# EAGLE design Rain Collector Inside v2 (EAGLE 7.1.0)
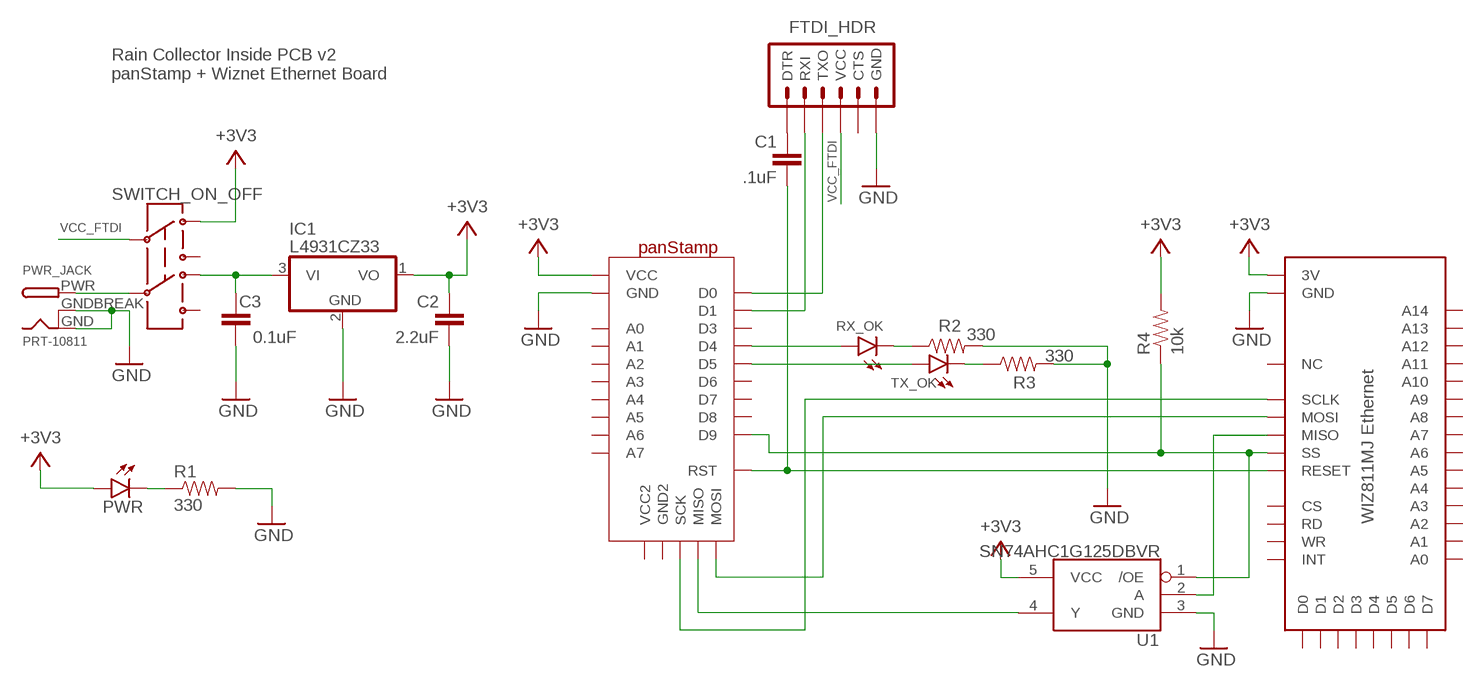
[diagram p0: schematic, sheet 1]

## Parts
C1  .1uF  CAPPTH1  [CAP-PTH-5MM]
C2  2.2uF  CAPPTH1  [CAP-PTH-5MM]
C3  0.1uF  CAPPTH1  [CAP-PTH-5MM]
FTDI_HDR  ARDUINO_SERIAL_PROGRAMLONGPADS  [1X06_LONGPADS]
IC1  L4931CZ33  78L15Z  [TO92]
PANSTAMP  PANSTAMP_SPI  [PANSTAMP_SPI]
PWR  LED5MM  [LED5MM]
PWR_JACK  PRT-10811  DCBARRELPTH  [DCJACK_2MM_PTH]
R1  330  RESISTORPTH-1/4W  [AXIAL-0.4]
R2  330  RESISTORPTH-1/4W  [AXIAL-0.4]
R3  330  RESISTORPTH-1/4W  [AXIAL-0.4]
R4  10k  RESISTORPTH-1/4W  [AXIAL-0.4]
RX_OK  LED5MM  [LED5MM]
SWITCH_ON_OFF  401-2001-ND  SWITCH_DPDTPTH  [SWITCH_DPDT_PTH]
TX_OK  LED5MM  [LED5MM]
U1  SN74AHC1G125DBVR  74AHC1G125  [SOT23-5]
U$2  WIZ811MJ  [WIZ811MJ]

## Nets
+3V3: C2.1 IC1.1(VO) PANSTAMP.VCC PWR.A R4.P$2 SWITCH_ON_OFF.1 U1.5(VCC) U$2.3V@1(3V) U$2.3V@2(3V)
DTR: C1.1 FTDI_HDR.1(DTR)
GND: C2.2 C3.2 FTDI_HDR.6(GND) IC1.2(GND) PANSTAMP.GND$1(GND) PANSTAMP.GND$7(GND) PANSTAMP.GND$15(GND) PANSTAMP.GND$23(GND) PANSTAMP.GND$24(GND) PWR_JACK.GND PWR_JACK.GNDBREAK R1.P$2 R2.P$2 R3.P$2 U1.3(GND) U$2.GND@1(GND) U$2.GND@2(GND) U$2.GND@3(GND) U$2.GND@4(GND) U$2.GND@5(GND)
MISO: PANSTAMP.MISO U1.4(Y)
MOSI: PANSTAMP.MOSI U$2.MOSI
N$1: FTDI_HDR.3(TXO) PANSTAMP.D0
N$2: FTDI_HDR.2(RXI) PANSTAMP.D1
N$3: PWR_JACK.PWR SWITCH_ON_OFF.5
N$4: PWR.K(C) R1.P$1
N$6: U1.2(A) U$2.MISO
N$7: R2.P$1 RX_OK.K(C)
N$8: R3.P$1 TX_OK.K(C)
N$9: C3.1 IC1.3(VI) SWITCH_ON_OFF.4
RST: C1.2 PANSTAMP.RESET(RST) U$2.RESET
RXLED: PANSTAMP.D4 RX_OK.A
SCLK: PANSTAMP.SCK U$2.SCLK
SS: PANSTAMP.D9 R4.P$1 U1.1(/OE) U$2.SCS(SS)
TXLED: PANSTAMP.D5 TX_OK.A
VCC_FTDI: FTDI_HDR.4(VCC) SWITCH_ON_OFF.2
Unconnected: FTDI_HDR.5(CTS) PANSTAMP.A0 PANSTAMP.A1 PANSTAMP.A2 PANSTAMP.A3 PANSTAMP.A4 PANSTAMP.A5 PANSTAMP.A6 PANSTAMP.A7 PANSTAMP.D3 PANSTAMP.D6 PANSTAMP.D7 PANSTAMP.D8 SWITCH_ON_OFF.3 SWITCH_ON_OFF.6 U$2.A0 U$2.A1 U$2.A2 U$2.A3 U$2.A4 U$2.A5 U$2.A6 U$2.A7 U$2.A8 U$2.A9 U$2.A10 U$2.A11 U$2.A12 U$2.A13 U$2.A14 U$2.CS U$2.D0 U$2.D1 U$2.D2 U$2.D3 U$2.D4 U$2.D5 U$2.D6 U$2.D7 U$2.INT U$2.NC U$2.RD U$2.WR

## Notes on the sheet
- Rain Collector Inside PCB v2
  panStamp + Wiznet Ethernet Board

## Power pins joined to a net without a drawn wire
GND2: PANSTAMP.GND2
VCC2: PANSTAMP.VCC2

## Library data of the parts
C1-C3 = SparkFun-Capacitors:CAP: Capacitor Standard 0603 ceramic capacitor, and 0.1" leaded capacitor.
FTDI_HDR = SparkFun-Connectors:ARDUINO_SERIAL_PROGRAM: FTDI connector footprints
IC1 = adafruit:78*: Positive VOLTAGE REGULATOR Added bigger pads to the TO-92 package
PANSTAMP = SRG:PANSTAMP_SPI
PWR RX_OK TX_OK = SparkFun-LED:LED: LEDs Standard schematic elements and footprints for 5mm, 3mm, 1206, and 0603 sized LEDs. 5mm - Spark Fun Electronics SKU : COM-00529 (and others)
PWR_JACK = adafruit:DCBARREL: 2.0mm DC Barrel Jack DCJACK_2MM_PTH - Through Hole Jack (4UConnector: 05537)
R1-R4 = SparkFun-Resistors:RESISTOR: Resistor Basic schematic elements and footprints for 0603, 1206, and PTH resistors.
SWITCH_ON_OFF = SRG:SWITCH_DPDT: Switch DPDT PTH version - C&K # JS202011CQN, Digikey #401-2001-ND 300 mA rating
U1 = SparkFun-DigitalIC:74AHC1G125: Single bus buffer gate with 3-state output
U$2 = SRG:WIZ811MJ: WIZnet W5100 Ethernet Network Module - WIZ811MJ Sparkfun https://www.sparkfun.com/products/9473 Product Page: http://bly/U4KDqQ

## Net classes
0 default: width 0.61 mm, drill 0.508 mm, clearance 0.381 mm

## Board
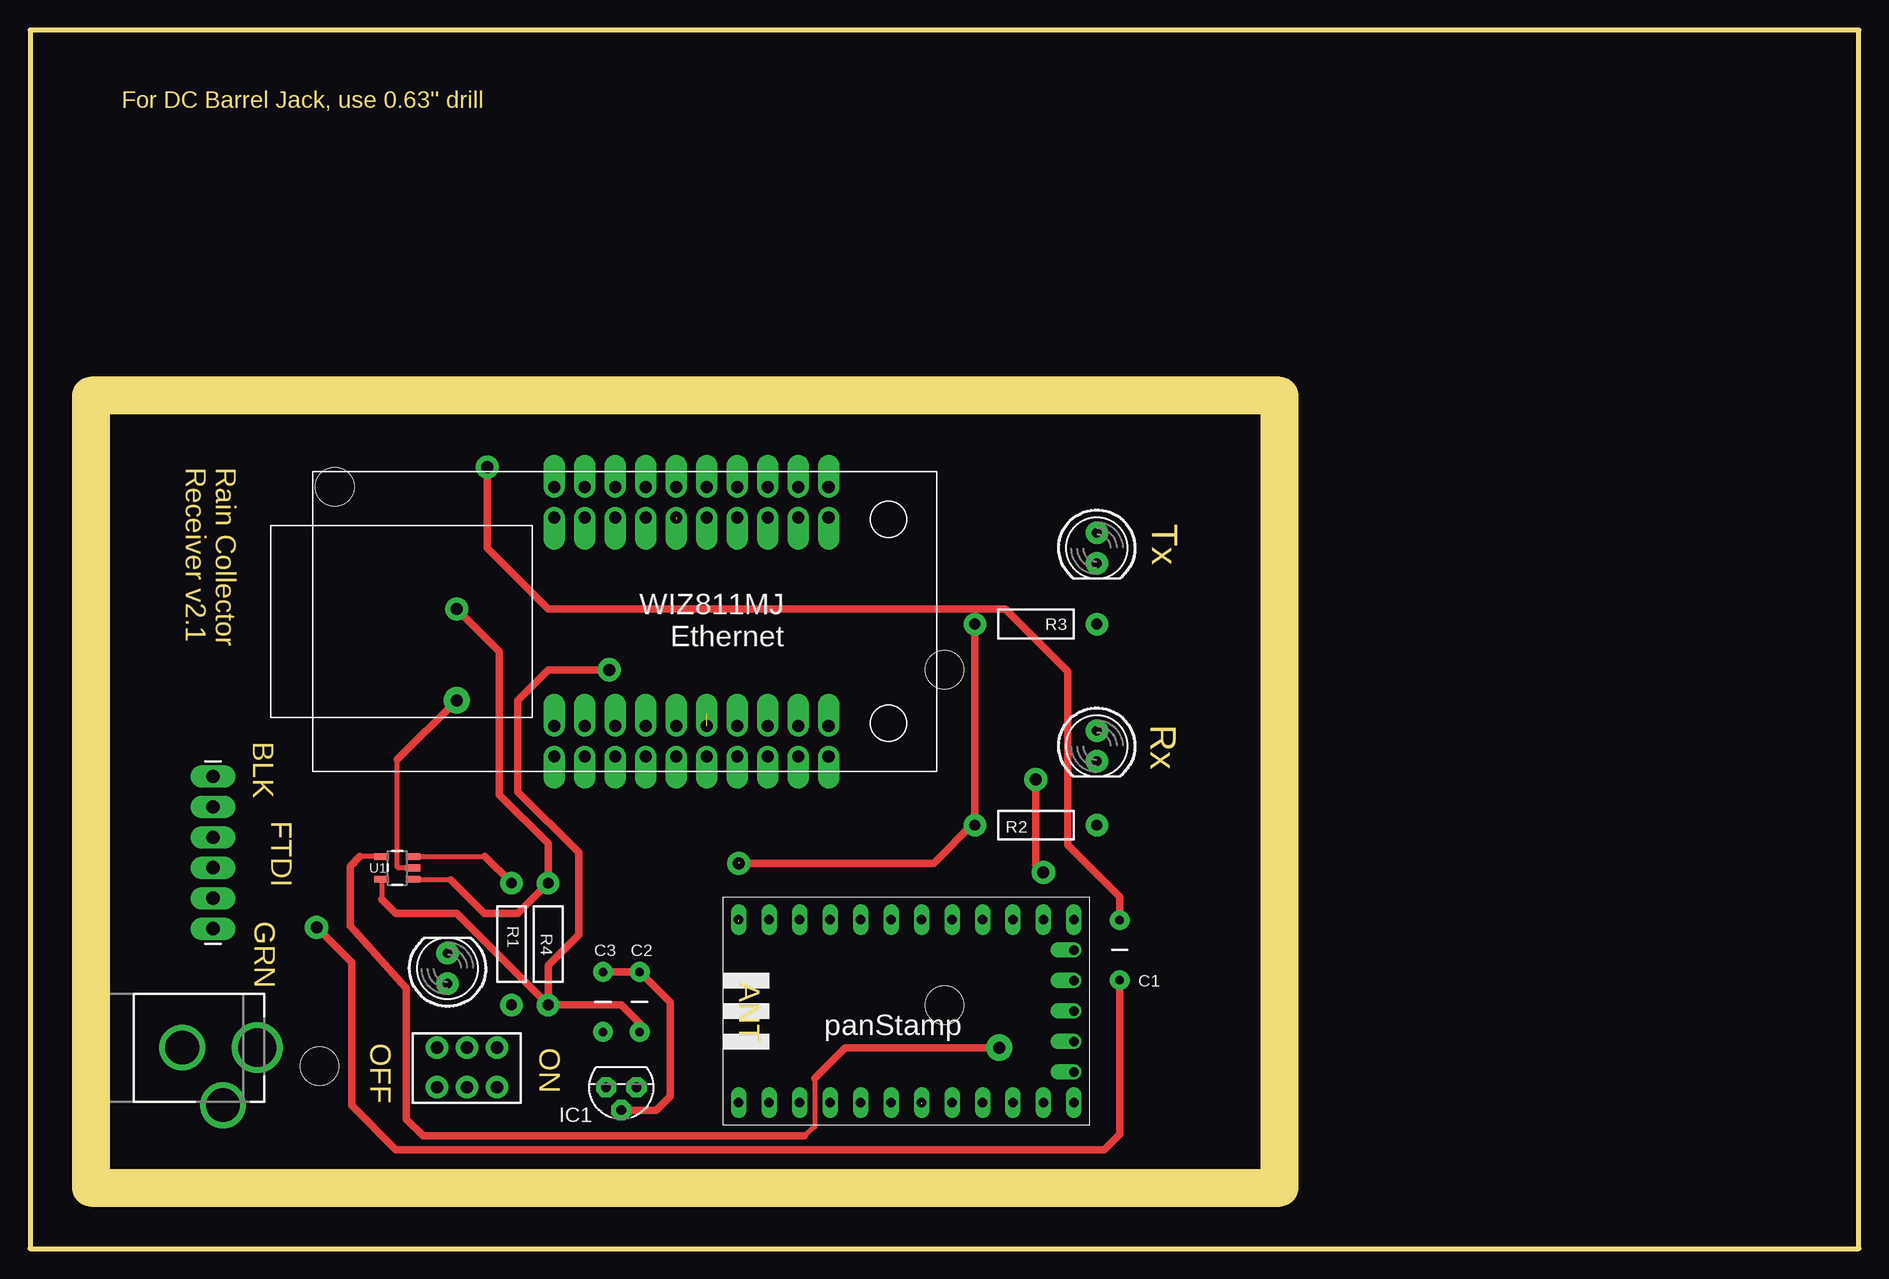
[diagram p1: board, top side]
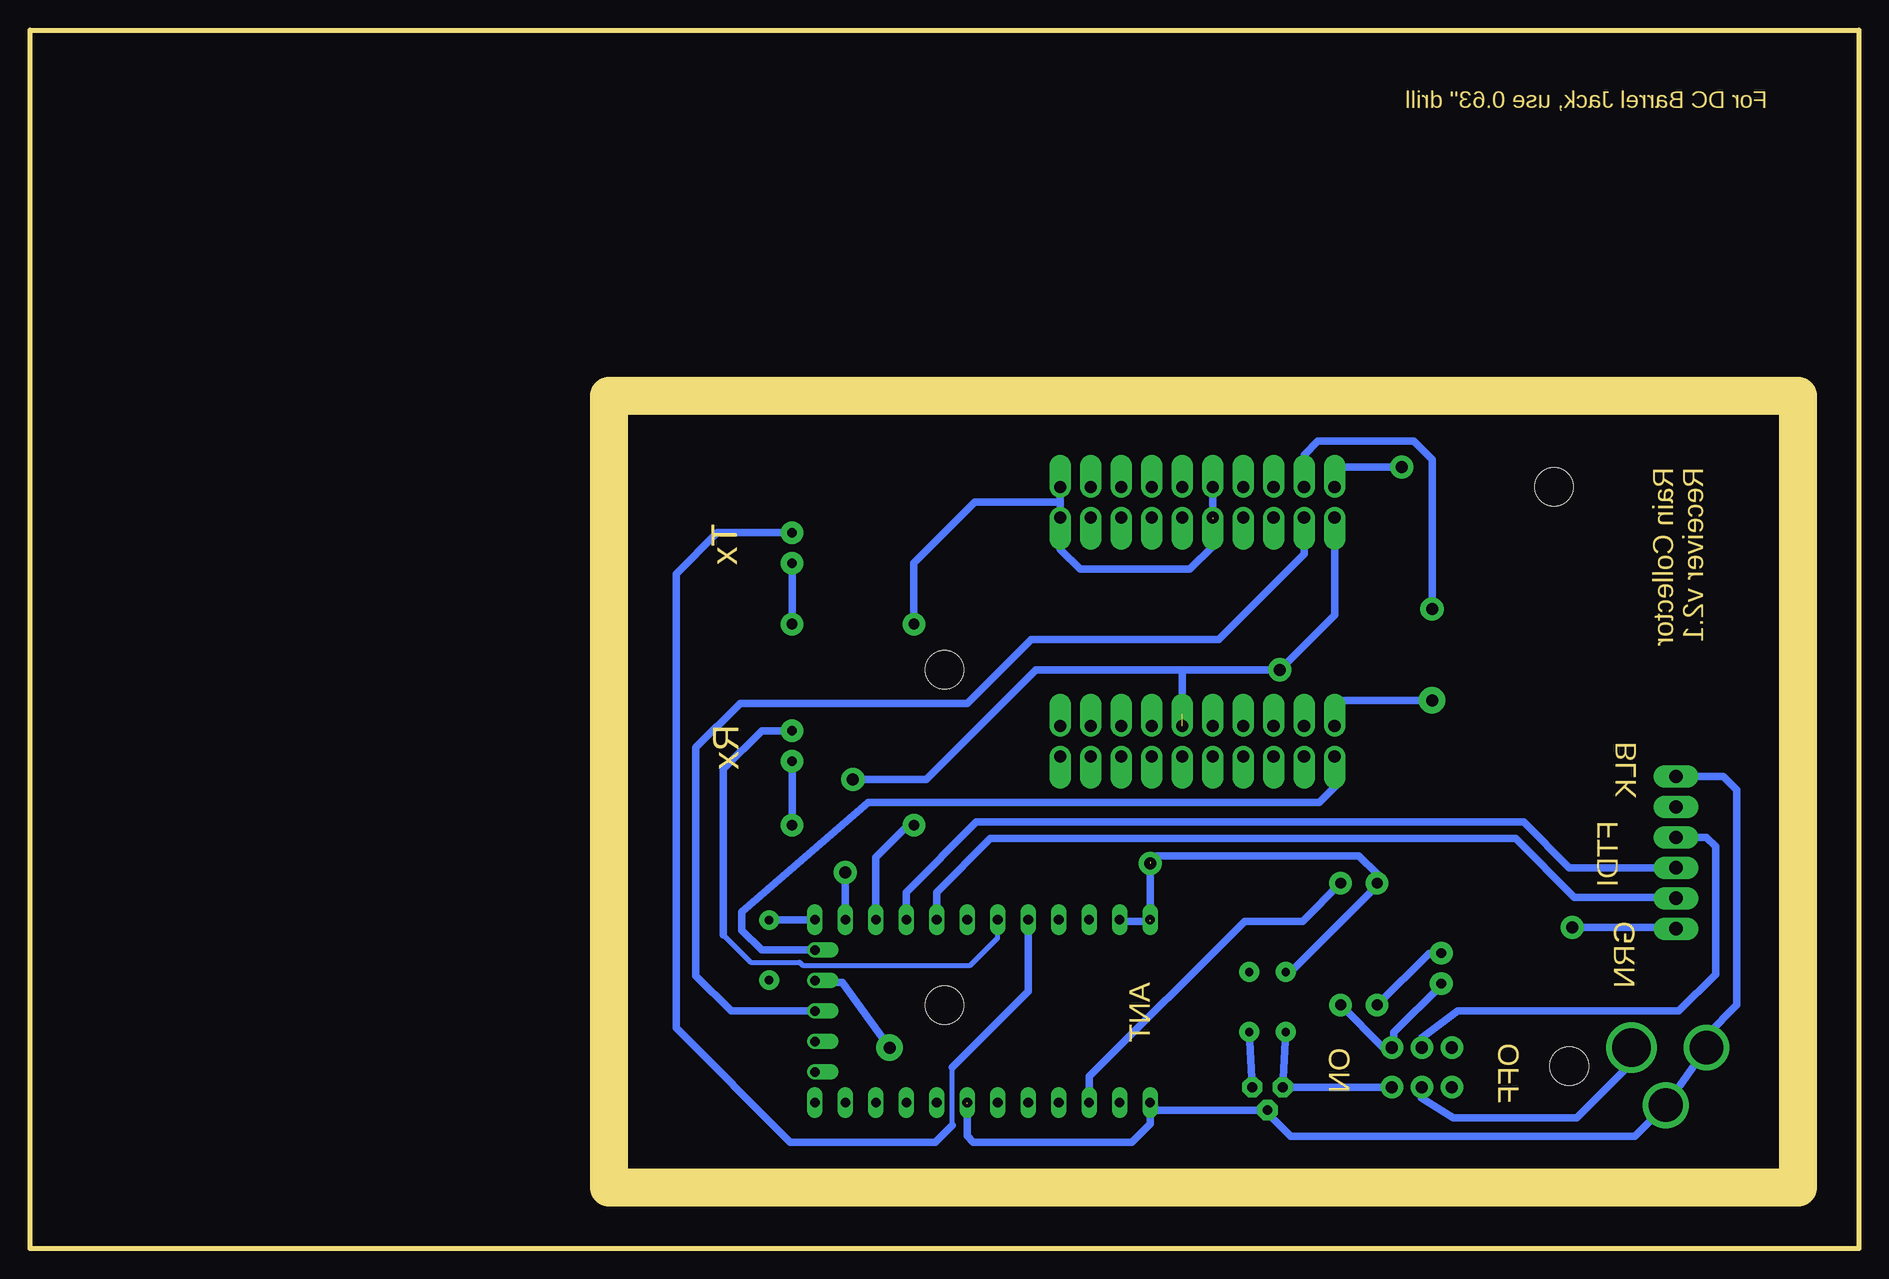
[diagram p2: board, bottom side, seen from below]

Size 152.4 x 101.6 mm. Coordinates in mm from the lower left corner, seen from the top.
Outline: 0,0 152.4,0 152.4,101.6 0,101.6 0,0
Copper layers (1*16): Top 0.035mm / dielectric 1.5mm / Bottom 0.035mm
Design rules "ShapeOko": minimum track width 12mil, minimum drill 24mil, track to track 25mil, track to pad 25mil, pad to pad 25mil, via to via 25mil, smd to smd 25mil, copper to edge 40mil, drill to drill 8mil, minimum pad ring 10mil, minimum via ring 8mil, stop-mask expansion 4mil, vias tented up to drill 0mil, thermal gap 10mil
Holes 3.2 mm at 25.4,63.5 24.13,15.24 76.2,20.32 76.2,48.26
Holes 0.6 mm at 5.08,5.08 104.14,5.08
Milling: 4 lines

### Footprints (pad centres in the part's own frame; a part is rotated, then mirrored left to right if it is on the bottom)
CAP-PTH-5MM = drill 0.7 pad 1.651: 1 -2.5,0; 2 2.5,0
1X06_LONGPADS = drill 1.118 pad 1.88 long: 1 0,0; 2 2.54,0; 3 5.08,0; 4 7.62,0; 5 10.16,0; 6 12.7,0
TO92 = drill 0.813 pad 1.676 octagon: 1 -1.27,0; 2 0,1.905; 3 1.27,0
PANSTAMP_SPI = drill 0.8 long: A0 -7.62,5.08; A1 -7.62,2.54; A2 -7.62,0; A3 -7.62,-5.08; A4 -7.62,-7.62; A5 -7.62,-10.16; A6 -7.62,-12.7; A7 -7.62,-15.24; D0 7.62,-7.62; D1 7.62,-5.08; D3 7.62,-2.54; D4 7.62,0; D5 7.62,2.54; D6 7.62,5.08; D7 7.62,7.62; D8 -7.62,10.16; D9 -7.62,7.62; GND$1 -7.62,12.7; GND$7 -7.62,-2.54; GND$15 7.62,-10.16; GND$23 7.62,10.16; GND$24 7.62,12.7; RESET 7.62,-15.24; VCC 7.62,-12.7 | drill 0.8 offset: GND2 -2.54,-15.24; MISO 2.54,-15.24; MOSI 5.08,-15.24; SCK 0,-15.24; VCC2 -5.08,-15.24
LED5MM = drill 0.813 pad 1.88: A -1.27,0; K 1.27,0
DCJACK_2MM_PTH = drill 2.8: GND 0,7.35; GNDBREAK 4.8,10.75 | drill 3.2: PWR 0,13.6
AXIAL-0.4 = drill 0.9 pad 1.88: P$1 -5.08,0; P$2 5.08,0
SWITCH_DPDT_PTH = drill 1.016 pad 1.88: 1 -1.651,2.46; 2 -1.651,-0.04; 3 -1.651,-2.54; 4 1.649,2.46; 5 1.649,-0.04; 6 1.649,-2.54
SOT23-5 = smd 0.55 x 1.2: 1 -0.95,-1.3; 2 0,-1.3; 3 0.95,-1.3; 4 0.95,1.3; 5 -0.95,1.3
WIZ811MJ = drill 1.016 pad 1.778 offset: 3V@1 10.16,9.76; 3V@2 22.86,-7.62; A0 10.16,-7.62; A1 10.16,-10.16; A2 7.62,-7.62; A3 7.62,-10.16; A4 5.08,-7.62; A5 5.08,-10.16; A6 2.54,-7.62; A7 2.54,-10.16; A8 7.62,12.3; A9 7.62,9.76; A10 5.08,12.3; A11 5.08,9.76; A12 2.54,12.3; A13 2.54,9.76; A14 0,12.3; CS 15.24,-7.62; D0 20.32,9.76; D1 20.32,12.3; D2 17.78,9.76; D3 17.78,12.3; D4 15.24,9.76; D5 15.24,12.3; D6 12.7,9.76; D7 12.7,12.3; GND@1 10.16,12.3; GND@2 12.7,-7.62; GND@3 0,-7.62; GND@4 12.7,-10.16; GND@5 0,-10.16; INT 15.24,-10.16; MISO 22.86,9.76; MOSI 22.86,12.3; NC 0,9.76; RD 17.78,-10.16; RESET 22.86,-10.16; SCLK 20.32,-7.62; SCS 20.32,-10.16; WR 17.78,-7.62

### Placement (x,y rotation side)
C1  90.81,24.89 90 top
C2  50.8,20.57 90 top
C3  47.75,20.57 90 top
FTDI_HDR  15.24,26.67 90 top
IC1  49.28,13.46 180 top
PANSTAMP  71.75,19.81 90 top
PWR  34.8,23.37 90 top
PWR_JACK  5.33,16.76 270 top
R1  40.13,25.4 90 top
R2  83.82,35.31 180 top
R3  83.82,52.07 180 top
R4  43.18,25.4 270 top
RX_OK  88.9,41.91 270 top
SWITCH_ON_OFF  36.45,15.11 270 top
TX_OK  88.9,58.42 270 top
U1  30.61,31.75 90 top
U$2  66.55,53.34 180 top

### Tracks (layer width: path | path; a pad name or v marks a point on that pad's centre or on a via)
+3V3  (via drill 1 pad 1.93)  (1 unrouted)
  Top 0.406: U1.5 29.31,29.11
  Top 0.61: R4.P$2 43.18,20.61 42.89,20.61 35.56,27.94 30.48,27.94 29.31,29.11 | C2.1 50.8,18.8 49.28,20.32 R4.P$2 | v83.82,39.12 83.82,32 v84.45,31.37 | R4.P$2 43.18,23.62 45.72,26.16 45.72,33.02 40.64,38.1 40.64,45.72 43.18,48.26 v48.26,48.26
  Bottom 0.61: IC1.1 C2.1 | v83.82,39.12 77.72,39.12 68.58,48.26 v48.26,48.26 43.69,52.83 U$2.3V@2 | v84.45,31.37 PANSTAMP.VCC | PWR.A 34.8,21.97 38.73,18.03 38.73,16.94 SWITCH_ON_OFF.1 39.62,16.76 R4.P$2 | 56.39,44.58 56.39,48.26
DTR  (via drill 1 pad 1.93)
  Top 0.61: C1.1 90.81,9.53 89.53,8.26 30.48,8.26 26.8,11.94 26.8,23.88 v23.88,26.8
  Bottom 0.61: v23.88,26.8 15.37,26.8 FTDI_HDR.1
GND  (via drill 1 pad 1.93)  (4 unrouted)
  Top 0.406: U1.3 37.91,32.7
  Top 0.61: C3.2 C2.2 53.34,20.53 53.34,12.7 52.2,11.56 IC1.2 | 37.91,32.7 R1.P$2 | v59.05,32.13 75.31,32.13 78.74,35.56 | R3.P$2 R2.P$2
  Bottom 0.61: PWR_JACK.GNDBREAK PWR_JACK.GND 12.68,17.8 10.16,20.32 10.16,38.23 11.3,39.37 FTDI_HDR.6 | U$2.GND@4 U$2.GND@2 | 66.55,63.37 66.55,62.23 | 66.55,62.23 U$2.GND@3 | R1.P$2 40.5,29.92 47.35,23.08 C3.2 | 16.23,11.87 PWR_JACK.GNDBREAK | 66.55,62.23 73.66,62.23 78.74,57.15 R3.P$2 | R2.P$2 79.25,35.31 81.92,32.64 PANSTAMP.GND$15 | PANSTAMP.GND$1 58.42,11.56 IC1.2 49.21,11.25 47.35,9.38 18.66,9.38 PWR_JACK.GNDBREAK | PANSTAMP.GND$24 v59.05,32.13 | 74.3,12.06 74.3,9.4 73.79,8.89 60.58,8.89 59.05,10.41 59.05,12.06 | 40.13,30.61 40.13,31.24 41.66,32.77 58.55,32.77 59.05,32.26 | 59.05,27.3 61.72,27.3 | 53.85,60.83 53.85,58.55 55.75,56.64 64.9,56.64 66.55,58.29 66.55,60.58 66.67,60.71
MISO  (via drill 1 pad 2.18)
  Top 0.406: U1.4 27.49,32.7 | 65.41,14.22 65.41,10.16 64.52,9.4
  Top 0.61: 27.49,32.7 26.67,31.88 26.67,26.92 31.37,21.72 31.37,10.79 32.77,9.4 64.52,9.4 | v80.77,16.76 67.94,16.76 65.41,14.22
  Bottom 0.61: v80.77,16.76 84.71,22.23 86.87,22.23 PANSTAMP.MISO
MOSI
  Bottom 0.61: PANSTAMP.MOSI 91.44,24.89 93.09,26.54 93.09,28.07 82.55,37.21 44.96,37.21 43.56,38.61 43.56,40.91 U$2.MOSI
N$1
  Bottom 0.61: FTDI_HDR.3 24.13,31.75 27.94,35.56 73.53,35.56 79.38,29.72 PANSTAMP.D0
N$2
  Bottom 0.61: FTDI_HDR.2 15.61,29.3 23.7,29.3 28.59,34.19 72.36,34.19 76.83,29.72 PANSTAMP.D1
N$3
  Bottom 0.61: SWITCH_ON_OFF.5 36.45,13.42 36.45,12.57 33.78,10.92 23.5,10.92 19.18,15.24 19.18,16.52 PWR_JACK.PWR
N$4
  Bottom 0.61: PWR.K 35.81,24.64 R1.P$1
N$6  (via drill 1 pad 2.18)
  Top 0.406: U1.2 30.61,31.75 30.61,40.77
  Top 0.61: 30.61,40.77 v35.56,45.72
  Bottom 0.61: v35.56,45.72 43.69,45.72 U$2.MISO
N$7
  Bottom 0.61: RX_OK.K R2.P$1
N$8
  Bottom 0.61: TX_OK.K R3.P$1
N$9
  Bottom 0.61: C3.1 IC1.3 SWITCH_ON_OFF.4
RST  (via drill 1 pad 1.93)
  Top 0.61: C1.2 90.81,29.34 86.49,33.66 86.49,48.13 81.28,53.34 43.18,53.34 38.1,58.42 v38.1,65.15
  Bottom 0.61: PANSTAMP.RESET 90.77,27.43 C1.2 | U$2.RESET 43.69,64.77 43.31,65.15 v38.1,65.15
RXLED
  Bottom 0.406: 94.61,26.16 92.33,23.88 88.27,23.88 88.01,23.62 74.04,23.62 71.75,25.91 PANSTAMP.D4
  Bottom 0.61: 94.61,26.16 94.61,40.01 91.44,43.18 RX_OK.A
SCLK
  Bottom 0.61: U$2.SCLK 46.23,57.91 53.34,50.8 68.96,50.8 74.3,45.47 93.22,45.47 96.9,41.78 96.9,22.73 93.98,19.81 PANSTAMP.SCK
SS  (via drill 1 pad 1.93)
  Top 0.406: 35.05,30.73 31.97,30.73 U1.1
  Top 0.61: 35.05,30.73 37.85,27.94 40.64,27.94 R4.P$1 43.18,33.78 39.12,37.85 39.12,49.78 v35.56,53.34
  Bottom 0.61: R4.P$1 46.35,27.3 51.18,27.3 64.14,14.35 PANSTAMP.D9 | v35.56,53.34 35.56,65.79 37.08,67.31 45.09,67.31 46.23,66.17 U$2.SCS
TXLED
  Bottom 0.406: 75.56,10.29 75.56,15.11
  Bottom 0.61: TX_OK.A 95.12,59.69 98.55,56.26 98.55,18.41 89.03,8.89 76.96,8.89 75.56,10.29 | 75.56,15.11 69.22,21.46 PANSTAMP.D5
VCC_FTDI
  Bottom 0.61: SWITCH_ON_OFF.2 36.41,17.57 33.4,19.81 14.99,19.81 11.94,22.86 11.94,33.53 12.7,34.29 FTDI_HDR.4

### Text on the board
Dimension: For DC Barrel Jack, use 0.63" drill
tPlace: panStamp
Milling: Rain Collector / Receiver v2.1 | Tx | Rx | BLK | FTDI | GRN | ANT | OFF | ON